# EAGLE design simple-loop2 (EAGLE 6.6.0)
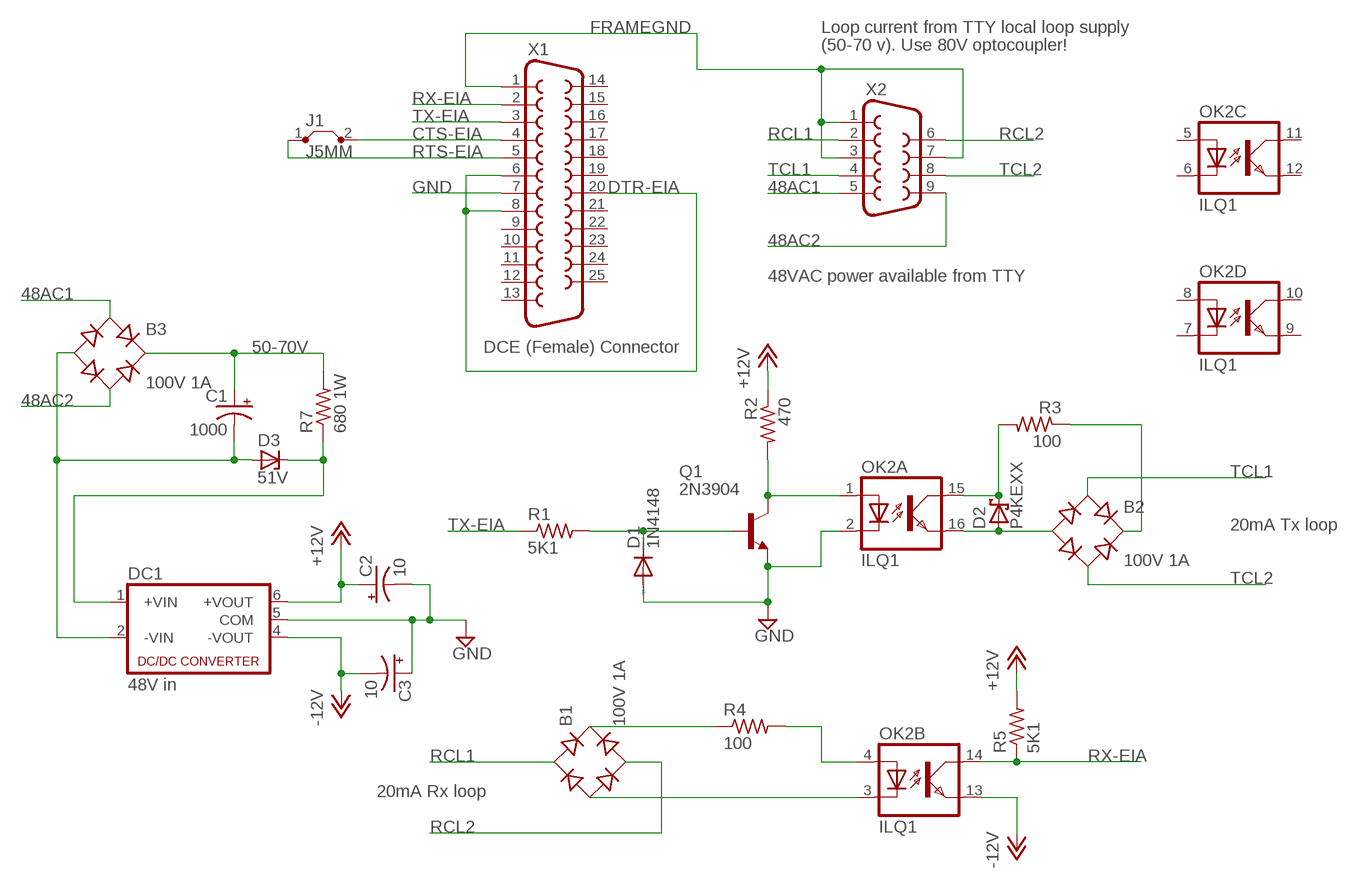
[diagram p0: schematic, sheet 1]

## Parts
B1  100V 1A  RB1A  [RB1A]
B2  100V 1A  RB1A  [RB1A]
B3  100V 1A  RB1A  [RB1A]
C1  1000  CPOL-USE7.5-18  [E7,5-18]
C2  10  CPOL-USB45181A  [B45181A]
C3  10  CPOL-USB45181A  [B45181A]
D1  1N4148  1N4148DO35-10  [DO35-10]
D2  P4KEXX  [DO41-10]
D3  51V  ZENER-DIODEDO41Z10  [DO41Z10]
DC1  48V in  NMA  [NMA]
J1  J5MM  [05]
OK2  ILQ1  [DIL16]
Q1  2N3904  [TO92]
R1  5K1  R-US_0207/10  [0207/10]
R2  470  R-US_0207/10  [0207/10]
R3  100  R-US_0207/10  [0207/10]
R4  100  R-US_0207/10  [0207/10]
R5  5K1  R-US_0207/10  [0207/10]
R7  680 1W  R-US_0617/17  [0617/17]
X1  F25H  [F25H]
X2  F09H  [F09H]

## Nets
48AC1: B3.AC1 X2.5
48AC2: B3.AC2 X2.9
50-70V: B3.+ C1.+ R7.2
+12V: C2.+ DC1.6(+VOUT) R2.1 R5.2
-12V: C3.- DC1.4(-VOUT) OK2.13(B:EMIT)
CTS-EIA: J1.2 X1.4
DTR-EIA: X1.6 X1.8 X1.20
FRAMEGND: X1.1 X2.1 X2.3 X2.7
GND: C2.- C3.+ D1.A DC1.5(COM) OK2.2(A:C) Q1.3(E) X1.7
N$1: OK2.4(B:A) R4.2
N$2: B1.+ R4.1
N$3: B1.- OK2.3(B:C)
N$4: B2.- D2.A OK2.16(A:EMIT)
N$5: B2.+ R3.1
N$6: D2.C OK2.15(A:COL) R3.2
N$7: D1.C Q1.2(B) R1.2
N$8: D3.C DC1.1(+VIN) R7.1
N$9: OK2.1(A:A) Q1.1(C) R2.2
N$10: B3.- C1.- D3.A DC1.2(-VIN)
RCL1: B1.AC1 X2.2
RCL2: B1.AC2 X2.6
RTS-EIA: J1.1 X1.5
RX-EIA: OK2.14(B:COL) R5.1 X1.2
TCL1: B2.AC1 X2.4
TCL2: B2.AC2 X2.8
TX-EIA: R1.1 X1.3
Unconnected: OK2.5(C:A) OK2.6(C:C) OK2.7(D:C) OK2.8(D:A) OK2.9(D:EMIT) OK2.10(D:COL) OK2.11(C:COL) OK2.12(C:EMIT) X1.9 X1.10 X1.11 X1.12 X1.13 X1.14 X1.15 X1.16 X1.17 X1.18 X1.19 X1.21 X1.22 X1.23 X1.24 X1.25

## Notes on the sheet
- Loop current from TTY local loop supply
- (50-70 v). Use 80V optocoupler!
- 48VAC power available from TTY
- DCE (Female) Connector
- 20mA Tx loop
- 20mA Rx loop

## Library data of the parts
B1-B3 = rectifier:RB1A: RECTIFIER 1 A
C1-C3 = rcl:CPOL-US: POLARIZED CAPACITOR, American symbol
D1 = diode:1N4148: DIODE high speed (Philips)
D2 = diode:P4KEXX: DIODE transient-voltage suppressor
D3 = diode:ZENER-DIODE: Z-Diode
DC1 = dc-dc-converter:NMA: DC-DC CONVERTER; MF: C & D TECHNOLOGIES, INC; MPN: NMA0515SC; OC_FARNELL: 1021434; OC_NEWARK: 61K3064
J1 = jumper:J: Bridge
OK2 = optocoupler:ILQ1: SIEMENS OPTO COUPLER; MF: VISHAY/TELEFUNKEN; MPN: ILQ1; OC_FARNELL: 1469501; OC_NEWARK: 88K1954
Q1 = transistor-npn:2N3904: NPN Transistor
R1-R5 R7 = rcl:R-US_: RESISTOR, American symbol
X1 = con-subd:F25: SUB-D; OC_FARNELL: unknown; OC_NEWARK: unknown
X2 = con-subd:F09: SUB-D; OC_FARNELL: unknown; OC_NEWARK: unknown

## Board
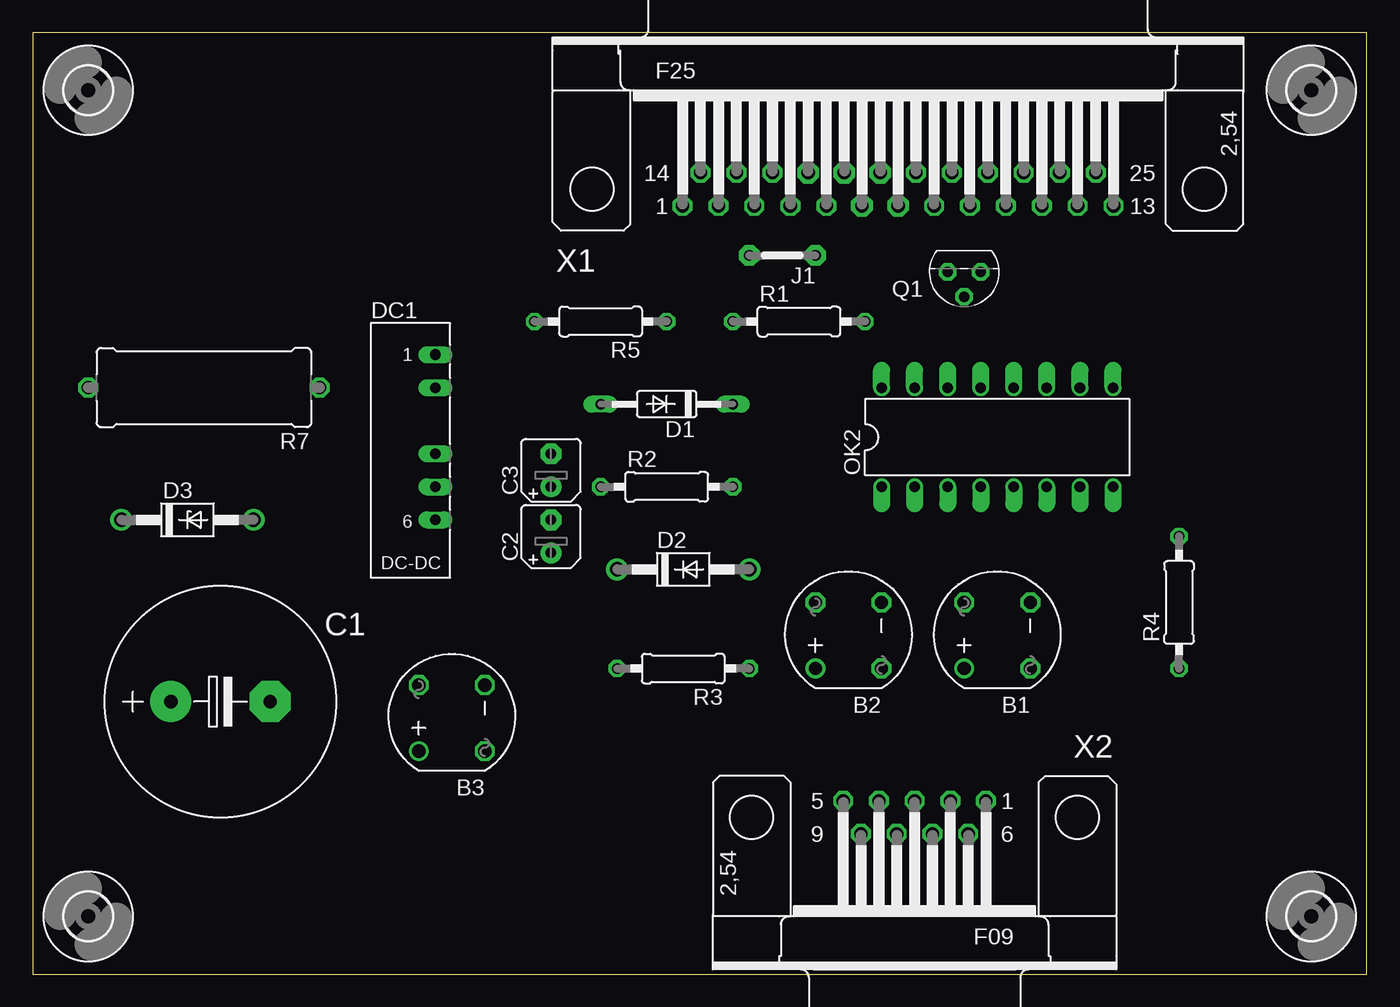
[diagram p1: board, top side]
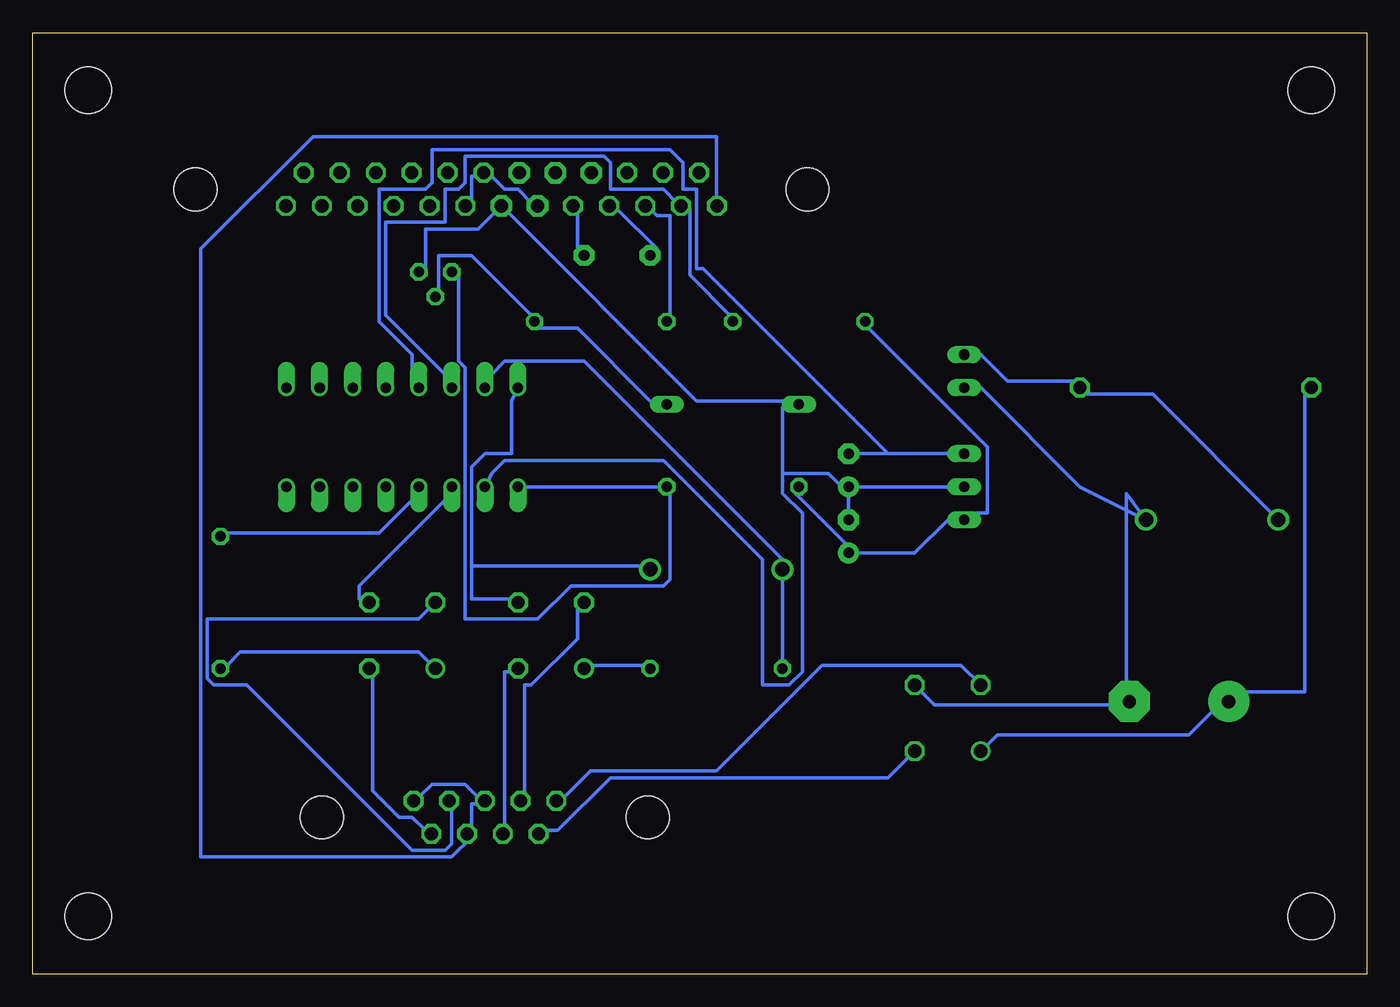
[diagram p2: board, bottom side, seen from below]

Size 102.54 x 72.37 mm. Coordinates in mm from the lower left corner, seen from the top.
Outline: 102.54,0 102.54,72.37 0,72.37 0,0 102.54,0
Copper layers (1*16): Top 0.035mm / dielectric 1.5mm / Bottom 0.035mm
Design rules "default *": minimum track width 10mil, minimum drill 24mil, track to track 8mil, track to pad 8mil, pad to pad 8mil, via to via 8mil, smd to smd 8mil, copper to edge 40mil, drill to drill 8mil, minimum pad ring 10mil, minimum via ring 8mil, stop-mask expansion 4mil, vias tented up to drill 0mil, thermal gap 10mil

### Footprints (pad centres in the part's own frame; a part is rotated, then mirrored left to right if it is on the bottom)
RB1A = drill 1.016: + -2.54,2.54 | drill 1.016 octagon: - 2.54,-2.54; AC1 2.54,2.54; AC2 -2.54,-2.54
E7,5-18 = drill 1.016 pad 3.15: + -3.81,0 | drill 1.016 pad 3.15 octagon: - 3.81,0
B45181A = drill 0.813 pad 1.6: + -1.27,0 | drill 0.813 pad 1.6 octagon: - 1.27,0
DO35-10 = drill 0.813 long: A 5.08,0; C -5.08,0
DO41-10 = drill 1.118: A 5.08,0; C -5.08,0
DO41Z10 = drill 1.118: A 5.08,0; C -5.08,0
NMA = drill 0.813 long: 1 0,6.35; 2 0,3.81; 4 0,-1.27; 5 0,-3.81; 6 0,-6.35
05 = drill 0.813 pad 1.6 octagon: 1 -2.54,0; 2 2.54,0
DIL16 = drill 0.813 offset: 1 -8.89,-3.81; 2 -6.35,-3.81; 3 -3.81,-3.81; 4 -1.27,-3.81; 5 1.27,-3.81; 6 3.81,-3.81; 7 6.35,-3.81; 8 8.89,-3.81; 9 8.89,3.81; 10 6.35,3.81; 11 3.81,3.81; 12 1.27,3.81; 13 -1.27,3.81; 14 -3.81,3.81; 15 -6.35,3.81; 16 -8.89,3.81
TO92 = drill 0.813 octagon: 1 1.27,0; 2 0,1.905; 3 -1.27,0
0207/10 = drill 0.813 octagon: 1 -5.08,0; 2 5.08,0
0617/17 = drill 1.016 octagon: 1 -8.89,0; 2 8.89,0
3,6 = hole 3.6: 0,0
F25H = drill 1.016 octagon: 1 -16.561,-1.27; 2 -13.792,-1.27; 3 -11.049,-1.27; 4 -8.28,-1.27; 5 -5.512,-1.27; 8 2.769,-1.27; 9 5.512,-1.27; 10 8.28,-1.27; 11 11.049,-1.27; 12 13.792,-1.27; 13 16.561,-1.27; 14 -15.189,1.27; 15 -12.421,1.27; 16 -9.652,1.27; 20 1.372,1.27; 21 4.14,1.27; 22 6.909,1.27; 23 9.652,1.27; 24 12.421,1.27; 25 15.189,1.27 | drill 1.016 pad 1.67 octagon: 6 -2.769,-1.27; 7 0,-1.27; 17 -6.909,1.27; 18 -4.14,1.27; 19 -1.372,1.27 | hole 3.302: -23.52,0; 23.52,0
F09H = drill 1.016 octagon: 1 -5.486,-1.27; 2 -2.743,-1.27; 3 0,-1.27; 4 2.743,-1.27; 5 5.486,-1.27; 6 -4.115,1.27; 7 -1.372,1.27; 8 1.372,1.27; 9 4.115,1.27 | hole 3.302: -12.522,0; 12.522,0

### Placement (x,y rotation side)
B1  74.13,26.03 90 top
B2  62.7,26.03 90 top
B3  32.22,19.68 90 top
C1  14.44,20.95 0 top
C2  39.84,33.65 90 top
C3  39.84,38.73 90 top
D1  48.73,43.81 180 top
D2  50,31.11 0 top
D3  11.9,34.92 0 top
DC1  30.95,41.27 0 top
J1  57.62,55.24 180 top
OK2  74.13,41.27 0 top
Q1  71.59,53.97 180 top
R1  58.89,50.16 0 top
R2  48.73,37.46 0 top
R3  50,23.49 180 top
R4  88.1,28.57 90 top
R5  43.65,50.16 180 top
R7  13.17,45.08 180 top
U$1  [3,6]  4.28,67.94 90 top
U$2  [3,6]  4.28,4.44 90 top
U$3  [3,6]  98.26,4.44 90 top
U$4  [3,6]  98.26,67.94 90 top
X1  66.51,60.32 0 top
X2  67.78,12.06 180 top

### Tracks (layer width: path | path; a pad name or v marks a point on that pad's centre or on a via)
48AC1
  Bottom 0.254: B3.AC1 31.2,23.74 41.87,23.74 50,15.62 59.65,15.62 61.68,13.58 X2.5
48AC2
  Bottom 0.254: B3.AC2 36.79,15.11 58.13,15.11 62.19,11.04 63.21,11.04 X2.9
50-70V
  Bottom 0.254: B3.+ 28.41,18.41 13.68,18.41 11.39,20.7 C1.+ 10.38,21.71 4.79,21.71 4.79,44.57 R7.2
+12V
  Bottom 0.254: R2.1 43.9,36.95 39.84,32.89 C2.+ 34.76,32.38 32.22,34.92 DC1.6 30.19,35.43 29.17,35.43 29.17,40.51 38.32,49.65 R5.2
-12V
  Bottom 0.254: 36.79,40 C3.- | DC1.4 36.79,40 | 36.79,40 51.02,54.22 51.52,54.22 51.52,60.32 52.54,60.32 52.54,62.35 53.56,63.37 71.84,63.37 71.84,60.83 72.35,60.32 75.91,60.32 75.91,50.16 73.37,47.62 73.37,46.1 OK2.13
CTS-EIA
  Bottom 0.254: X1.4 57.62,58.8 54.57,55.75 J1.2
DTR-EIA
  Bottom 0.254: X1.6 64.22,59.3 65.24,60.32 66.26,60.32 67.27,61.34 X1.20 68.29,61.34 68.8,61.34 68.8,59.3 X1.8
FRAMEGND
  Bottom 0.254: X2.1 72.86,13.58 71.84,14.6 69.3,14.6 68.29,13.58 X2.3 68.29,13.08 68.8,13.08 68.8,11.04 X2.7 68.8,10.54 70.32,9.01 89.62,9.01 89.62,55.75 80.99,64.38 50,64.38 50,59.3 X1.1
GND
  Bottom 0.254: Q1.3 72.35,54.22 72.35,57.27 68.29,57.27 X1.7 51.52,44.06 44.92,44.06 D1.A 44.92,43.56 44.92,38.48 | C3.+ C2.- | C3.+ DC1.5 | 44.92,38.48 44.92,36.95 43.4,35.43 43.4,23.24 44.41,22.22 46.44,22.22 46.44,31.87 54.06,39.49 66.26,39.49 67.27,38.48 OK2.2 | 44.92,38.48 41.36,38.48 40.35,37.46 C3.+
N$1
  Bottom 0.254: OK2.4 73.37,36.44 75.91,33.9 87.59,33.9 R4.2
N$2
  Bottom 0.254: R4.1 87.59,23.74 86.58,24.76 72.86,24.76 B1.+
N$3
  Bottom 0.254: OK2.3 70.83,36.44 77.43,29.84 77.43,28.82 76.92,28.82 B1.-
N$4
  Bottom 0.254: 68.8,31.36 68.8,28.82 65.75,28.82 B2.- | 68.8,31.36 68.8,38.98 67.78,40 65.75,40 65.75,44.06 OK2.16 | 68.8,31.36 55.59,31.36 D2.A
N$5
  Bottom 0.254: R3.1 55.59,23.74 59.65,23.74 B2.+
N$6
  Bottom 0.254: R3.2 D2.C 44.92,31.87 60.16,47.11 66.26,47.11 67.27,46.1 OK2.15
N$7
  Bottom 0.254: D1.C 55.08,44.06 60.67,49.65 63.72,49.65 R1.2 64.22,50.67 68.8,55.24 71.34,55.24 71.34,52.7 Q1.2
N$8
  Bottom 0.254: DC1.1 29.68,47.62 27.65,45.59 22.57,45.59 R7.1 21.55,44.57 16.47,44.57 D3.C
N$9
  Bottom 0.254: OK2.1 R2.2 53.56,36.95 53.56,30.35 54.06,29.84 61.18,29.84 63.72,27.3 69.3,27.3 69.3,46.6 69.81,47.11 69.81,53.72 Q1.1
N$10
  Bottom 0.254: B3.- 33.24,20.7 19.01,20.7 C1.- 18.5,21.71 18.5,36.95 D3.A 22.06,37.46 29.68,45.08 DC1.2
RCL1
  Bottom 0.254: X2.2 70.32,13.08 70.32,10.03 70.83,9.52 73.37,9.52 86.07,22.22 88.61,22.22 89.12,22.73 89.12,27.3 72.86,27.3 B1.AC1
RCL2
  Bottom 0.254: X2.6 72.35,11.04 73.37,12.06 74.38,12.06 76.42,14.09 76.42,23.24 B1.AC2
RTS-EIA
  Bottom 0.254: X1.5 60.67,58.8 60.67,55.75 J1.1
RX-EIA
  Bottom 0.254: R5.1 48.98,50.67 52.03,53.72 52.03,58.8 X1.2 53.05,59.3 54.06,60.32 58.13,60.32 58.13,62.35 58.64,62.86 69.3,62.86 69.3,60.83 69.81,60.32 70.83,60.32 70.83,57.78 75.4,57.78 75.4,50.67 70.83,46.1 OK2.14
TCL1
  Bottom 0.254: X2.4 64.73,13.58 64.73,22.22 64.22,22.22 60.67,25.78 60.67,28.32 B2.AC1
TCL2
  Bottom 0.254: X2.8 66.26,11.04 66.26,23.24 65.75,23.24 B2.AC2
TX-EIA
  Bottom 0.254: R1.1 53.56,50.67 53.56,58.29 54.57,58.29 55.08,58.8 X1.3